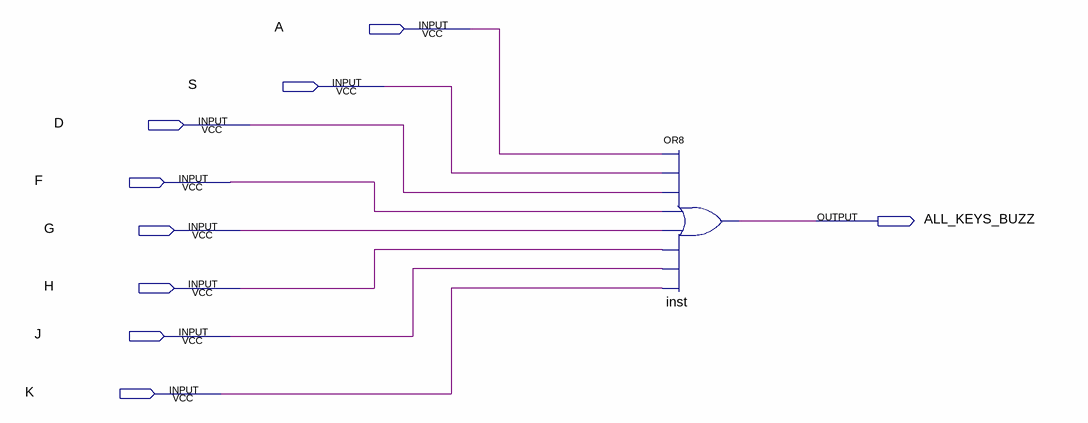
[diagram p0: schematic sheet]
// Quartus schematic AllKeysBuzz.bdf as structural Verilog: 1 symbols, 9 pins
module AllKeysBuzz (
  input  A,
  input  S,
  input  D,
  input  F,
  input  G,
  input  H,
  input  J,
  input  K,
  output ALL_KEYS_BUZZ
);

  or inst (ALL_KEYS_BUZZ, A, S, D, F, G, H, J, K);
endmodule
